# EAGLE design MUV_Noise_pcb (EAGLE 9.1.3)
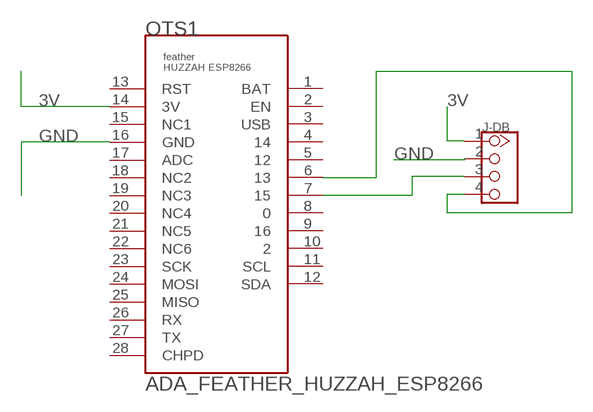
[diagram p0: schematic, sheet 1]

## Parts
J-DB  TWIG-4P-2.0-2.0  [4P-2.0]
OTS1  ADA_FEATHER_HUZZAH_ESP8266  [ADA_FEATHER_HUZZAH_ESP8266]

## Nets
3V: J-DB.1 OTS1.14(3V)
GND: J-DB.2 OTS1.16(GND)
N$1: J-DB.3 OTS1.7
N$2: J-DB.4 OTS1.6
Unconnected: OTS1.2(EN) OTS1.4 OTS1.5 OTS1.8 OTS1.9 OTS1.10 OTS1.11(SCL) OTS1.12(SDA) OTS1.13(RST) OTS1.15(NC1) OTS1.17(ADC) OTS1.18(NC2) OTS1.19(NC3) OTS1.20(NC4) OTS1.21(NC5) OTS1.22(NC6) OTS1.23(SCK) OTS1.24(MOSI) OTS1.25(MISO) OTS1.26(RX) OTS1.27(TX) OTS1.28(CHPD)

## Power pins joined to a net without a drawn wire
BAT: OTS1.1(BAT)
USB: OTS1.3(USB)

## Library data of the parts
J-DB = Connector:TWIG-4P-2.0
OTS1 = OTS:ADA_FEATHER_HUZZAH_ESP8266: Manufacture: Adafruit Prduct number: 2821 Type: development board Measures: 51mm x 23mm x 8mm without headers Supporting materilas: product page <https://www.adafruit.com/product/2821>

## Net classes
0 default: clearance 0.4 mm

## Board
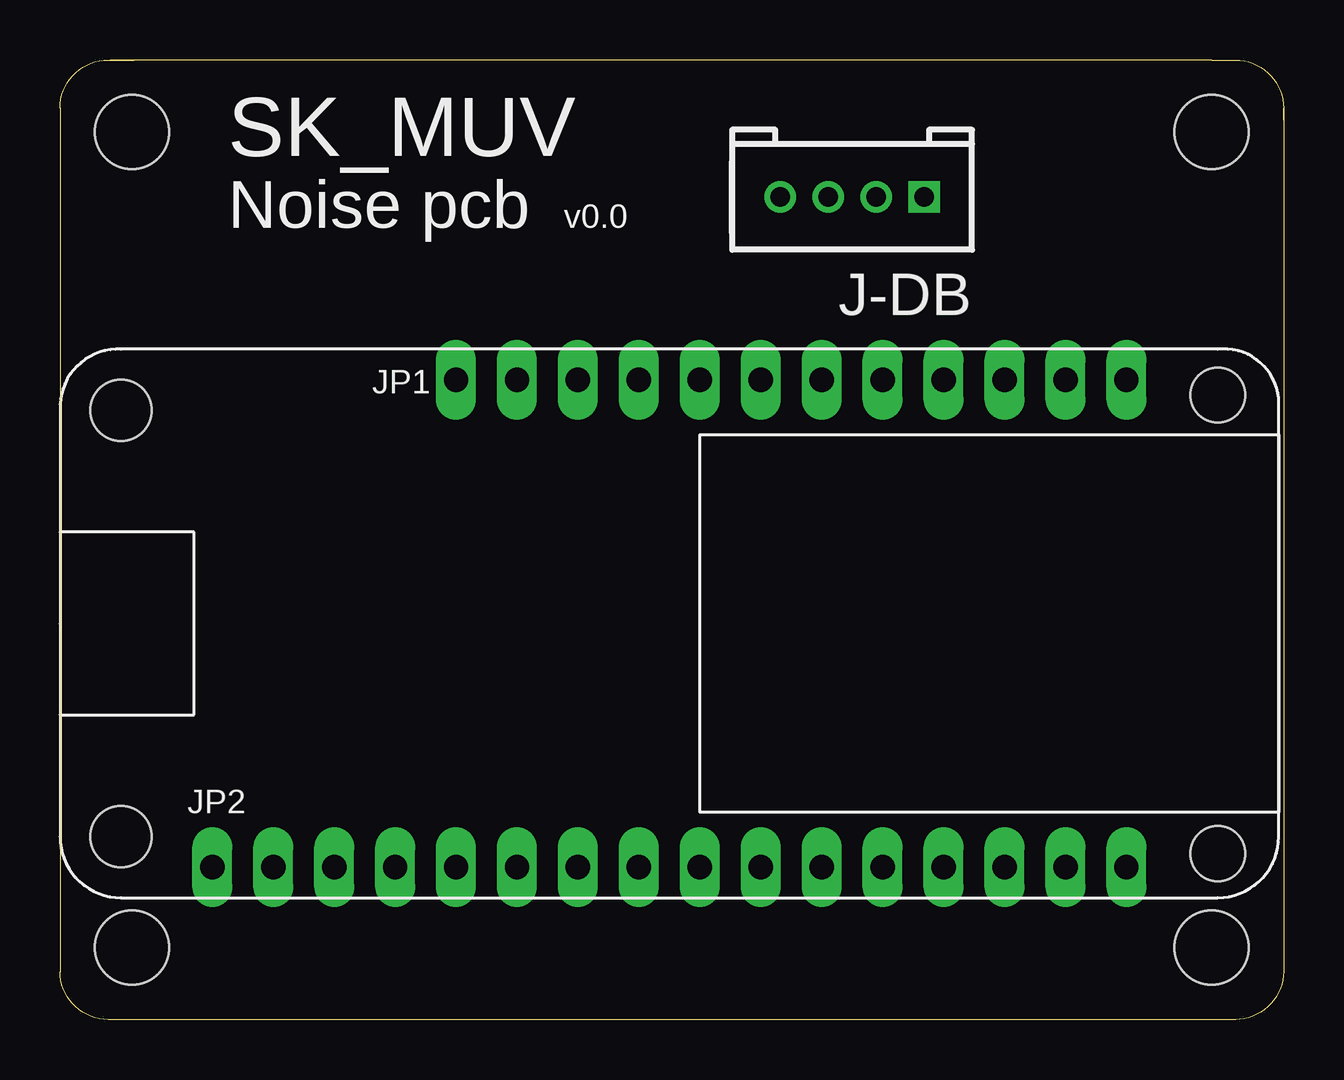
[diagram p1: board, top side]
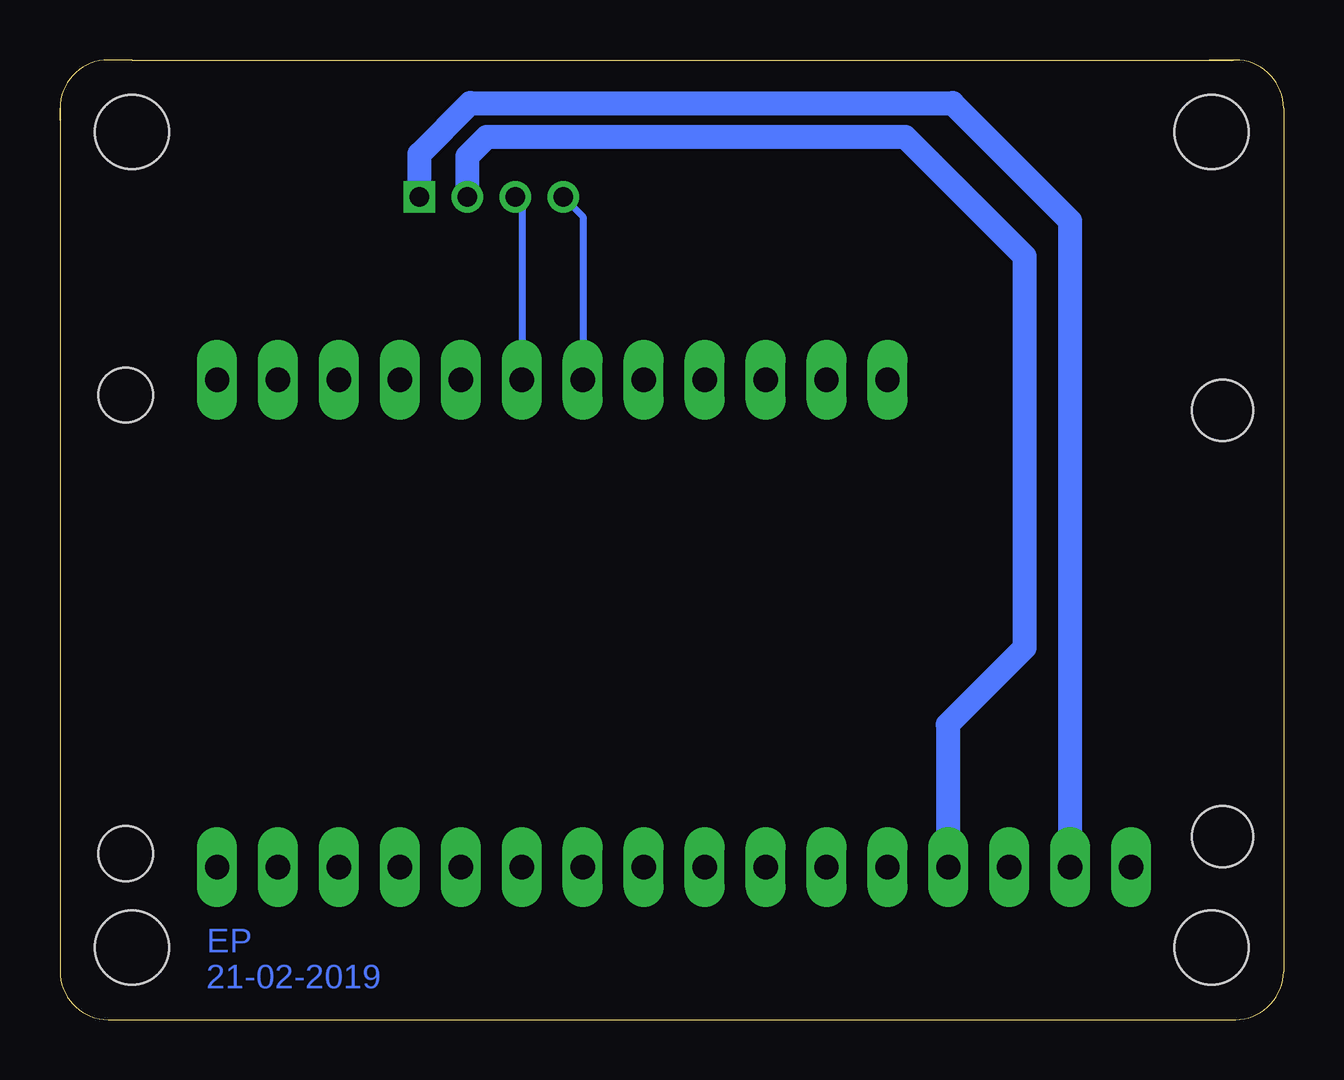
[diagram p2: board, bottom side, seen from below]

Size 51 x 40 mm. Coordinates in mm from the lower left corner, seen from the top.
Outline: 51,37.5 51,38
Outline: 3.1,40 48,40 49,40 arc-90 51,38
Outline: 3.1,40 2.1,40
Outline: 0,38 0,37.7
Outline: 51,38 51,37.5
Outline: 0,38 arc-90 2,40 2.1,40
Outline: 0,38 0,37.7
Outline: 2.1,40 3.1,40
Outline: 51,37.5 51,2 arc-90 49,0 2,0 arc-90 0,2 0,37.7
Copper layers (1*16): Top 0.035mm / dielectric 1.5mm / Bottom 0.035mm
Design rules "default": minimum track width 6mil, minimum drill 0.35mm, track to track 6mil, track to pad 6mil, pad to pad 6mil, via to via 6mil, smd to smd 6mil, copper to edge 40mil, drill to drill 6mil, minimum pad ring 10mil, minimum via ring 8mil, stop-mask expansion 4mil, vias tented up to drill 0mil, thermal gap 10mil
Holes 3.1 mm at 3,3 3,37 48,37 48,3

### Footprints (pad centres in the part's own frame; a part is rotated, then mirrored left to right if it is on the bottom)
4P-2.0 = drill 0.813 pad 1.27 square: 1 -3,0 | drill 0.813 pad 1.27: 2 -1,0; 3 1,0; 4 3,0
ADA_FEATHER_HUZZAH_ESP8266 = drill 1.016 pad 1.676 long: 1 16.51,21.59; 2 19.05,21.59; 3 21.59,21.59; 4 24.13,21.59; 5 26.67,21.59; 6 29.21,21.59; 7 31.75,21.59; 8 34.29,21.59; 9 36.83,21.59; 10 39.37,21.59; 11 41.91,21.59; 12 44.45,21.59; 13 6.35,1.27; 14 8.89,1.27; 15 11.43,1.27; 16 13.97,1.27; 17 16.51,1.27; 18 19.05,1.27; 19 21.59,1.27; 20 24.13,1.27; 21 26.67,1.27; 22 29.21,1.27; 23 31.75,1.27; 24 34.29,1.27; 25 36.83,1.27; 26 39.37,1.27; 27 41.91,1.27; 28 44.45,1.27 | hole 2.286: 48.26,1.841; 48.26,20.955 | hole 2.54: 2.54,2.54; 2.54,20.32

### Placement (x,y rotation side)
J-DB  33.02,34.29 180 top
OTS1  0,5.08 0 top

### Tracks (layer width: path | path; a pad name or v marks a point on that pad's centre or on a via)
3V
  Bottom 1: J-DB.1 36.02,36.08 33.9,38.2 13.8,38.2 8.9,33.3 OTS1.14
GND
  Bottom 1: J-DB.2 34.02,35.98 33.2,36.8 15.78,36.8 10.8,31.82 10.8,15.5 14,12.3 14,6.38 OTS1.16
N$1
  Bottom 0.3: J-DB.3 31.75,34.02 OTS1.7
N$2
  Bottom 0.3: J-DB.4 29.2,33.47 OTS1.6

### Text on the board
Bottom: EP / 21-02-2019
tPlace: SK_MUV | Noise pcb | v0.0 | JP1 | JP2